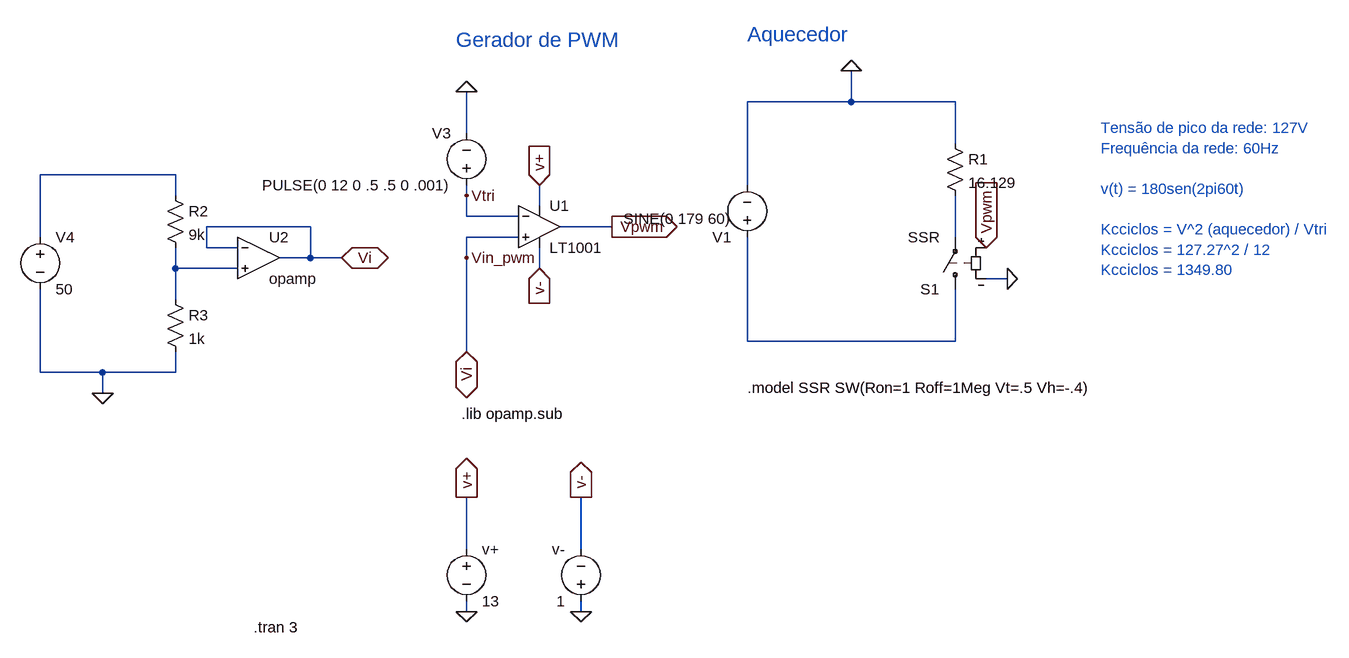
[diagram p0: schematic atuador.asc]
atuador.asc, the LTspice schematic file:
Version 4
SHEET 1 1820 792
WIRE 704 -32 704 -80
WIRE 704 -32 544 -32
WIRE 864 -32 704 -32
WIRE 112 16 112 -48
WIRE 864 32 864 -32
WIRE -336 80 -544 80
WIRE 544 96 544 -32
WIRE -336 112 -336 80
WIRE 112 112 112 96
WIRE 224 128 224 96
WIRE 112 144 112 112
WIRE 192 144 112 144
WIRE -128 160 -288 160
WIRE 336 160 256 160
WIRE -544 176 -544 80
WIRE 192 176 112 176
WIRE 864 176 864 112
WIRE -288 192 -288 160
WIRE -240 192 -288 192
WIRE -128 208 -128 160
WIRE -128 208 -176 208
WIRE -80 208 -128 208
WIRE 112 208 112 176
WIRE -336 224 -336 192
WIRE -240 224 -336 224
WIRE 224 224 224 192
WIRE 944 240 912 240
WIRE -336 272 -336 224
WIRE 544 336 544 176
WIRE 864 336 864 256
WIRE 864 336 544 336
WIRE 112 352 112 208
WIRE -544 384 -544 256
WIRE -448 384 -544 384
WIRE -336 384 -336 352
WIRE -336 384 -448 384
WIRE -448 416 -448 384
WIRE 112 656 112 576
WIRE 288 656 288 576
WIRE 112 752 112 736
WIRE 288 752 288 736
FLAG 112 -48 0
FLAG 112 112 Vtri
FLAG 112 208 Vin_pwm
FLAG 336 160 Vpwm
IOPIN 336 160 Out
FLAG 112 752 0
FLAG 288 752 0
FLAG 112 576 v+
IOPIN 112 576 Out
FLAG 288 576 v-
IOPIN 288 576 Out
FLAG 224 224 v-
IOPIN 224 224 In
FLAG 224 96 v+
IOPIN 224 96 In
FLAG 944 240 0
FLAG 912 192 Vpwm
IOPIN 912 192 In
FLAG 704 -80 0
FLAG -448 416 0
FLAG -80 208 Vi
IOPIN -80 208 BiDir
FLAG 112 352 Vi
IOPIN 112 352 BiDir
SYMBOL voltage 112 112 R180
WINDOW 0 24 96 Left 2
WINDOW 3 24 16 Left 2
WINDOW 123 0 0 Left 0
WINDOW 39 0 0 Left 0
SYMATTR InstName V3
SYMATTR Value PULSE(0 12 0 .5 .5 0 .001)
SYMBOL voltage 112 640 R0
WINDOW 123 0 0 Left 0
WINDOW 39 0 0 Left 0
SYMATTR InstName v+
SYMATTR Value 13
SYMBOL voltage 288 752 R180
WINDOW 0 24 96 Left 2
WINDOW 3 24 16 Left 2
WINDOW 123 0 0 Left 0
WINDOW 39 0 0 Left 0
SYMATTR InstName v-
SYMATTR Value 1
SYMBOL OpAmps\\LT1001 224 96 R0
SYMATTR InstName U1
SYMBOL sw 864 272 R180
SYMATTR InstName S1
SYMATTR Value SSR
SYMBOL res 848 16 R0
SYMATTR InstName R1
SYMATTR Value 16.129
SYMBOL voltage 544 192 R180
WINDOW 3 24 44 Left 2
WINDOW 123 0 0 Left 0
WINDOW 39 0 0 Left 0
SYMATTR Value SINE(0 179 60)
SYMATTR InstName V1
SYMBOL voltage -544 160 R0
WINDOW 123 0 0 Left 0
WINDOW 39 0 0 Left 0
SYMATTR InstName V4
SYMATTR Value 50
SYMBOL res -352 96 R0
SYMATTR InstName R2
SYMATTR Value 9k
SYMBOL res -352 256 R0
SYMATTR InstName R3
SYMATTR Value 1k
SYMBOL OpAmps\\opamp -208 144 R0
SYMATTR InstName U2
TEXT 104 448 Left 2 !.lib opamp.sub
TEXT 544 408 Left 2 !.model SSR SW(Ron=1 Roff=1Meg Vt=.5 Vh=-.4)
TEXT 544 -136 Left 3 ;Aquecedor
TEXT 96 -128 Left 3 ;Gerador de PWM
TEXT 1088 8 Left 2 ;Tensão de pico da rede: 127V\nFrequência da rede: 60Hz\n \nv(t) = 180sen(2pi60t)\n \nKcciclos = V^2 (aquecedor) / Vtri\nKcciclos = 127.27^2 / 12\nKcciclos = 1349.80
TEXT -216 776 Left 2 !.tran 3

The netlist it stands for:
* atuador.asc
V3 Vtri 0 PULSE(0 12 0 .5 .5 0 .001)
v+ v+ 0 13
v- 0 v- 1
XU1 Vi Vtri v+ v- Vpwm LT1001  ; pins In+ In- V+ V- OUT
S1 N004 N002 Vpwm 0 SSR
R1 0 N002 16.129
V1 N004 0 SINE(0 179 60)
V4 N001 0 50
R2 N001 N003 9k
R3 N003 0 1k
XU2 Vi N003 Vi opamp Aol=100K GBW=10Meg  ; pins invin noninvin out
.lib opamp.sub
.model SSR SW(Ron=1 Roff=1Meg Vt=.5 Vh=-.4)
* Aquecedor
* Gerador de PWM
* Tensão de pico da rede: 127V
* Frequência da rede: 60Hz
* v(t) = 180sen(2pi60t)
* Kcciclos = V^2 (aquecedor) / Vtri
* Kcciclos = 127.27^2 / 12
* Kcciclos = 1349.80
.tran 3
.lib LTC.lib
.backanno
.end